# Altium schematic sheet Controller_Board_Interface.SchDoc
size Letter; Organization: Midnight Sun Solar Rayce Car Team; Address1: University of Waterloo; Address2: 200 University Ave W; Address3: Waterloo, ON, Canada; Address4: N2L 3E9; Website: www.uwmidsun.com
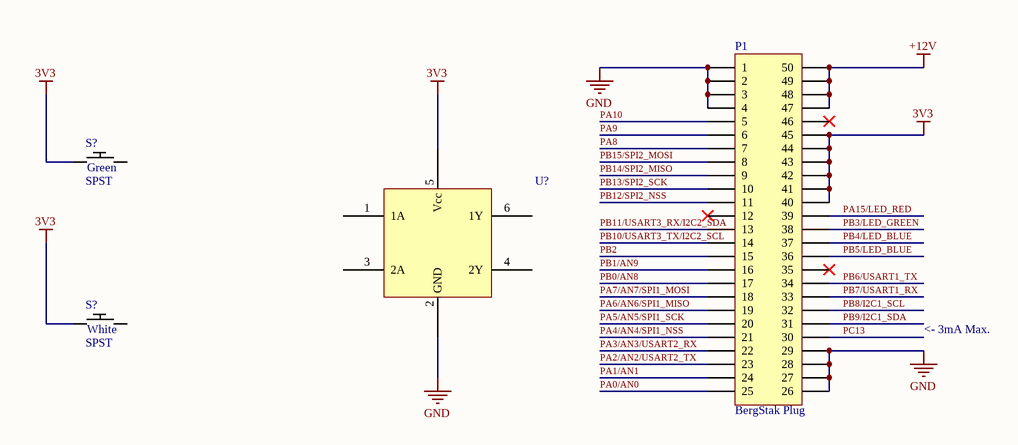
[diagram p0: Controller_Board_Interface.SchDoc]

## Parts
(Parts that share a designator on the sheet are numbered #1, #2 ... from top to bottom, then left to right.)
P1  Series: BergStak Plug  [CONN, Bergstak 50 Pos Plug]  (hidden comment: CONN 50POS Bergstak Plug 0.02")
S?#1  SPST  [SW SPST D6 SERIES GREEN]
S?#2  SPST  [SW SPST D6 SERIES WHITE]
U?  IC INVERTER SCHMITT 2CH 6TSOP  [IC INVERTER SCHMITT 2CH 6TSOP]  (value not drawn)

## Nets
3V3: P1.40 P1.41 P1.42 P1.43 P1.44 P1.45 S?#1.1 S?#2.1 U?.5(Vcc)
+12V: P1.47 P1.48 P1.49 P1.50
GND: P1.1 P1.2 P1.3 P1.4 P1.26 P1.27 P1.28 P1.29 U?.2(GND)
PA0/AN0: P1.25
PA1/AN1: P1.24
PA2/AN2/USART2_TX: P1.23
PA3/AN3/USART2_RX: P1.22
PA4/AN4/SPI1_NSS: P1.21
PA5/AN5/SPI1_SCK: P1.20
PA6/AN6/SPI1_MISO: P1.19
PA7/AN7/SPI1_MOSI: P1.18
PA8: P1.7
PA9: P1.6
PA10: P1.5
PA15/LED_RED: P1.39
PB0/AN8: P1.17
PB1/AN9: P1.16
PB2: P1.15
PB3/LED_GREEN: P1.38
PB4/LED_BLUE: P1.37
PB5/LED_BLUE: P1.36
PB6/USART1_TX: P1.34
PB7/USART1_RX: P1.33
PB8/I2C1_SCL: P1.32
PB9/I2C1_SDA: P1.31
PB10/USART3_TX/I2C2_SCL: P1.14
PB11/USART3_RX/I2C2_SDA: P1.13
PB12/SPI2_NSS: P1.11
PB13/SPI2_SCK: P1.10
PB14/SPI2_MISO: P1.9
PB15/SPI2_MOSI: P1.8
PC13: P1.30

Not connected (* = marked no-connect by the designer): P1 12* 35* 46*; S?#1 2; S?#2 2; U? 1(1A) 3(2A) 4(2Y) 6(1Y)

## Notes on the sheet
- <- 3mA Max.
- Project:
- Title:
- Size:
- Project Author
- Letter
- Revision:
- University of Waterloo
- 200 University Ave W
- Waterloo, ON, Canada
- N2L 3E9
- Date:
- Sheet
- of
- Website:

## Library data of the parts
P1 = CONN 50POS Bergstak Plug 0.02": 50 Position Connector Plug, Outer Shroud Contacts Surface Mount Gold; Manufacturer 1: Amphenol FCI; Manufacturer Part Number 1: 10132797-055100LF; Number of Positions: 50; Mated Stacking Heights: 5mm; Pitch: 0.020" (0.50mm); Supplier 1: Digi-Key; Supplier Part Number 1: 609-5226-1-ND; Packaging: Cut Tape (CT); Part Status: Active; Connector Type: Plug, Outer Shroud Contacts; Number of Rows: 2; Mounting Type: Surface Mount; Contact Finish: Gold; Contact Finish Thickness: 1µin (0.025µm); Height Above Board: 0.169" (4.30mm); ComponentLink1URL: http://portal.fciconnect.com/Comergent//fci/drawing/10132797.pdf; ComponentLink1Description: http://portal.fciconnect.com/Comergent//fci/drawing/10132797.pdf
S?#1 = SW SPST-NO 0.1A 32V D6 Series Green: Pushbutton Switch SPST-NO Keyswitch Through Hole D6 Series Green; Manufacturer: C&K; Manufacturer Part Number: D6R50 F1 LFS; Switch Function: Off-Mom; Current Rating: 100mA (DC); Voltage Rating - DC: 32V; Actuator Type: Round, Button; Electrical Life: 250,000 Cycles; Supplier 1: Digi-Key; RoHS: RoHS Compliant; Category: Switches; Stock 1: 3742; Pricing 1: 1=1.73, 10=1.607, 25=1.5308, 50=1.454, 100=1.4158, 250=1.37756, 500=1.30102, 1000=1.22448, 5000=1.03316 (CAD); Packaging: Bulk; Part Status: Active; Type: Keyswitch; Circuit: SPST-NO; Voltage Rating - AC: -; Color - Actuator/Cap: Green; Illumination Type, Color: -; Illumination Voltage (Nominal): -; Mounting Type: Through Hole; Termination Style: PC Pin; Ingress Protection: -; Features: Tactile Feedback; Panel Cutout Dimensions: -; Operating Temperature: -20°C ~ 85°C; Mechanical Life: -; ComponentLink1URL: http://www.ckswitches.com/media/1341/d6.pdf; ComponentLink1Description: http://www.ckswitches.com/media/1341/d6.pdf; Supplier Part Number 1: 401-1976-ND
S?#2 = SW SPST-NO 0.1A 32V D6 Series White: Pushbutton Switch SPST-NO Keyswitch Through Hole D6 Series White; Manufacturer: C&K; Manufacturer Part Number: D6R00 F2 LFS; Switch Function: Off-Mom; Current Rating: 100mA (DC); Voltage Rating - DC: 32V; Actuator Type: Round, Button; Electrical Life: 250,000 Cycles; Supplier 1: Digi-Key; RoHS: RoHS Compliant; Category: Switches; Stock 1: 6244; Pricing 1: 1=1.64, 10=1.532, 25=1.4584, 50=1.3856, 100=1.3492, 250=1.31272, 500=1.2398, 1000=1.16686, 5000=0.98454 (CAD); Packaging: Bulk; Part Status: Active; Type: Keyswitch; Circuit: SPST-NO; Voltage Rating - AC: -; Color - Actuator/Cap: White; Illumination Type, Color: -; Illumination Voltage (Nominal): -; Mounting Type: Through Hole; Termination Style: PC Pin; Ingress Protection: -; Features: Tactile Feedback; Panel Cutout Dimensions: -; Operating Temperature: -20°C ~ 85°C; Mechanical Life: -; ComponentLink1URL: http://www.ckswitches.com/media/1341/d6.pdf; ComponentLink1Description: http://www.ckswitches.com/media/1341/d6.pdf; Supplier Part Number 1: 401-1989-ND; Supplier 2: Digi-Key; Stock 2: 3742; Pricing 2: 1=1.73, 10=1.607, 25=1.5308, 50=1.454, 100=1.4158, 250=1.37756, 500=1.30102, 1000=1.22448, 5000=1.03316 (CAD); Supplier Part Number 2: 401-1976-ND
U? = IC INVERTER SCHMITT 2CH 6TSOP : Inverter IC 2 Channel Schmitt Trigger 6-TSOP; Manufacturer: Nexperia; Manufacturer Part Number: 74HC2G14GW-Q100H; Description: Inverter Schmitt Trigger 2-Element CMOS 6-Pin TSSOP T/R; RoHS: No; Supplier 1: Digi-Key; Stock 1: 5264; Pricing 1: 1 = 0.44000, 10 = 0.32700, 25 = 0.28600, 100 = 0.18510, 250 = 0.15328, 500 = 0.12262, 1000 = 0.09400 (USD); ComponentLink1URL: https://assets.nexperia.com/documents/data-sheet/74LVC2G14_Q100.pdf?src-supplier=Digi-Key; ComponentLink1Description: https://assets.nexperia.com/documents/data-sheet/74LVC2G14_Q100.pdf?src-supplier=Digi-Key; Supplier Part Number 1: 1727-2071-1-ND